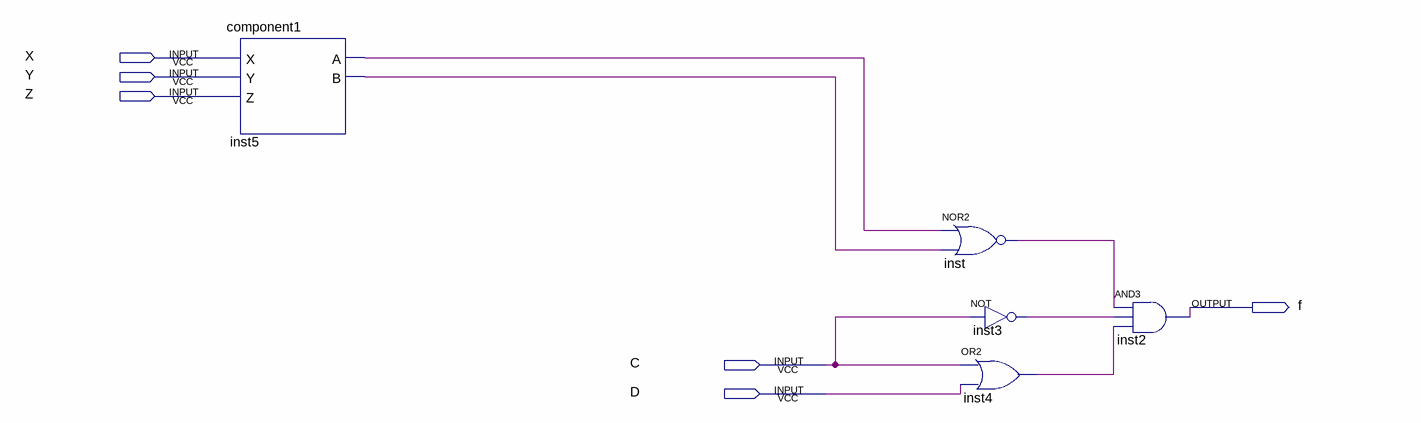
[diagram p0: schematic sheet]
// Quartus schematic Assi1.bdf as structural Verilog: 5 symbols, 6 pins
module Assi1 (
  input  X,
  input  Y,
  input  Z,
  input  C,
  input  D,
  output f
);

  wire inst3_out, inst4_out, inst5_a, inst5_b, inst_out;

  component1 inst5 (.X(X), .Y(Y), .Z(Z), .A(inst5_a), .B(inst5_b));
  nor inst (inst_out, inst5_a, inst5_b);
  not inst3 (inst3_out, C);
  or inst4 (inst4_out, C, D);
  and inst2 (f, inst_out, inst3_out, inst4_out);
endmodule
